# Altium schematic sheet 1_P1.schdoc
size 429 x 307 mm; Symbol: Drawing-Symbol_A4; Device: Drawing-Symbol_A4; Company: 嘉立创EDA; Version: V1.0; Page Size: A4; @Project Name: PCB1; @Page Count: 1; @Update Date: 2025-07-21; @Create Date: 2025-07-21; @Schematic Name: Schematic3; @Page No: 1; @Page Name: P1; @Create Time: 16:02:15; @Update Time: 16:02:15; Width: 1655; Height: 1170; Region Start: 1; X Region Count: 6; Y Region Count: 4; Blade Width: 10; Title Block Position: 3; @Board Name: 压力传感器
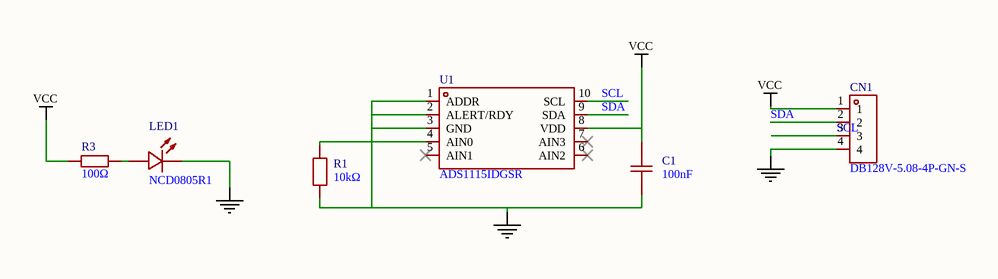
[diagram p0: 1_P1.schdoc]

## Parts
C1  100nF  [C0603]
CN1  DB128V-5.08-4P-GN-S  [CONN-TH_4P-P5.08_DIBO_DB128V-5.08]
LED1  NCD0805R1  [LED0805-R-RD]
R1  10kΩ  [R0603]
R3  100Ω  [R0603]
U1  ADS1115IDGSR  [MSOP-10_L3.0-W3.0-P0.50-LS5.0-BL]

## Nets
GND: C1.1 CN1.4 LED1.2(-) R1.1 U1.1(ADDR) U1.2(ALERT/RDY) U1.3(GND)
VCC: C1.2 CN1.1 R3.1 U1.8(VDD)
SCL: CN1.3 U1.10(SCL)
SDA: CN1.2 U1.9(SDA)
NetLED1_1: LED1.1(+) R3.2
NetR1_2: R1.2 U1.4(AIN0)

Not connected (* = marked no-connect by the designer): U1 5(AIN1)* 6(AIN2)* 7(AIN3)*

## Notes on the sheet
- 1
- 2
- 3
- 4
- 5
- 6
- A
- B
- C
- 原理图
- Schematic3
- 创建日期
- 更新日期
- 2025-07-21
- D
- 板子
- 绘制
- 压力传感器
- 图页
- P1
- 审阅
- 版本
- 尺寸
- PCB1
- 页    1    共    1
- V1.0
- A4
- 嘉立创EDA

## Library data of the parts
C1 = CGA0603X7R104K500JT: Manufacturer: HRE(芯声); Add into BOM: yes; Tolerance: ±10%; Voltage Rating: 50V; Temperature Coefficient: X7R; Symbol: CGA0603X7R104K500JT; Device: CGA0603X7R104K500JT; LCSC Part Name: 100nF ±10% 50V; Supplier Part: C6119867; Manufacturer Part: CGA0603X7R104K500JT; Supplier Footprint: 0603; JLCPCB Part Class: 扩展库; Datasheet: https://atta.szlcsc.com/upload/public/pdf/source/20250103/C44077DA9E7B3EFAE02F22B6D3D1CBC9.pdf; Supplier: LCSC; Convert to PCB: yes; Value: 100nF
CN1 = DB128V-5.08-4P-GN-S: Manufacturer: DORABO(地博电气); Add into BOM: yes; Number of Positions or Pins: 1x4P; Pitch: 5.08mm; Number of PINs Per Row: 4; Screw Specification: M2.5; Current Rating: 16A; Voltage Rating (Max): 300V; Wire Gauge - AWG: 12~22; Wire Gauge - mm2: 2.5; Symbol: DB128V-5.08-4P-GN-S; Device: DB128V-5.08-4P-GN-S; LCSC Part Name: 1x4P 5.08mm 直插 排数:1 每排P数:4; Supplier Part: C2915641; Manufacturer Part: DB128V-5.08-4P-GN-S; Supplier Footprint: 插件,P=5.08mm; Datasheet: https://atta.szlcsc.com/upload/public/pdf/source/20230106/CC449C10514519CDCE20F1C37DBF2DAC.pdf; Supplier: LCSC; Convert to PCB: yes; Color: 绿色; Mounting Type: 直插; Number of Pins: 4P; Number of Rows: 1; Operating Temperature: -40℃~+105℃
LED1 = NCD0805R1: Manufacturer: 国星光电; Symbol: FC-2012HRK-620D; Add into BOM: yes; Emitted Color: 红色; Forward Voltage (VF): 1.6V~2.6V; Power Dissipation: 65mW; Forward Current: 20mA; Dominant Wavelength: 615nm~630nm; Diode Configuration: 独立二极管; Lens Color: 无色透明透镜; Luminous Intensity: 67mcd~195mcd; Viewing Angle: 130°; Device: NCD0805R1; LCSC Part Name: NCD0805R1; Supplier Part: C84256; Manufacturer Part: NCD0805R1; Supplier Footprint: 0805; JLCPCB Part Class: 基础库; Datasheet: https://atta.szlcsc.com/upload/public/pdf/source/20200820/C84256_F0A75A43B3EAD75808600A0514C76B99.pdf; Supplier: LCSC; Convert to PCB: yes; Lamp Holder Type: -; Peak Wavelength: -; Color Temperature: -; Mounting Sytle: -; Operating Temperature: -30℃~+85℃
R1 = FRC0603J103 TS: Manufacturer: FOJAN(富捷); Add into BOM: yes; Tolerance: ±5%; Power(Watts): 100mW; Voltage-Supply(Max): 75V; Temperature Coefficient: ±100ppm/℃; Symbol: FRC0603J103TS; Device: FRC0603J103 TS; LCSC Part Name: 10kΩ ±5% 100mW 厚膜电阻; Supplier Part: C2930027; Manufacturer Part: FRC0603J103 TS; Supplier Footprint: 0603; JLCPCB Part Class: 扩展库; Datasheet: https://atta.szlcsc.com/upload/public/pdf/source/20211221/925EC7D7225764EE0046F22065062C87.pdf; Supplier: LCSC; Convert to PCB: yes; Type: 厚膜电阻; Value: 10kΩ; Operating Temperature: -55℃~+155℃
R3 = 0603WAF1000T5E: Manufacturer: UNI-ROYAL(厚声); Add into BOM: yes; Tolerance: ±1%; Power(Watts): 100mW; Overload Voltage (Max): 75V; Temperature Coefficient: ±200ppm/℃; Symbol: 0603WAF1000T5E; Device: 0603WAF1000T5E; LCSC Part Name: 100Ω ±1% 100mW 厚膜电阻; Supplier Part: C22775; Manufacturer Part: 0603WAF1000T5E; Supplier Footprint: 0603; JLCPCB Part Class: 基础库; Datasheet: https://atta.szlcsc.com/upload/public/pdf/source/20200306/C422600_1E6D84923E4A46A82E41ADD87F860B5C.pdf; Supplier: LCSC; Convert to PCB: yes; Type: 厚膜电阻; Value: 100Ω; Operating Temperature Range: -55℃~+155℃
U1 = ADS1115IDGSR: Manufacturer: TI(德州仪器); Add into BOM: yes; Resolution(Bits): 16位; number of channels: 4; Voltage - Supply: 2V~5.5V; Interface: I2C; Integral non - linearity: 1LSB; Symbol: ADS1115IDGSR; Device: ADS1115IDGSR; LCSC Part Name: 具有内部基准、振荡器和可编程比较器且兼容 I2C 的ADS111x、超小型、低功耗 860SPS、16位ADC; Supplier Part: C37593; Manufacturer Part: ADS1115IDGSR; Supplier Footprint: VSSOP-10; Datasheet: https://www.ti.com/cn/lit/gpn/ads1115; Supplier: LCSC; Convert to PCB: yes; Sampling Rate: -; differential input: -; Operating Temperature: -40℃~+125℃